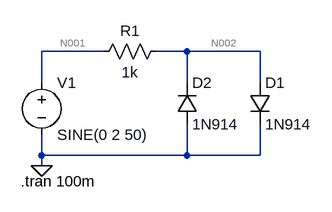
[diagram p0: schematic Lab2_fourth.asc]
Lab2_fourth.asc, the LTspice schematic file:
Version 4
SHEET 1 880 680
WIRE 64 48 -32 48
WIRE 192 48 144 48
WIRE 304 48 192 48
WIRE -32 96 -32 48
WIRE 192 96 192 48
WIRE 304 96 304 48
WIRE -32 208 -32 176
WIRE 192 208 192 160
WIRE 192 208 -32 208
WIRE 304 208 304 160
WIRE 304 208 192 208
WIRE -32 224 -32 208
FLAG -32 224 0
SYMBOL voltage -32 80 R0
WINDOW 123 0 0 Left 2
WINDOW 39 0 0 Left 2
SYMATTR InstName V1
SYMATTR Value SINE(0 2 50)
SYMBOL res 160 32 R90
WINDOW 0 0 56 VBottom 2
WINDOW 3 32 56 VTop 2
SYMATTR InstName R1
SYMATTR Value 1k
SYMBOL diode 288 96 R0
SYMATTR InstName D1
SYMATTR Value 1N914
SYMBOL diode 176 160 M180
WINDOW 0 24 64 Left 2
WINDOW 3 24 0 Left 2
SYMATTR InstName D2
SYMATTR Value 1N914
TEXT -64 248 Left 2 !.tran 100m

The netlist it stands for:
* Lab2_fourth.asc
V1 N001 0 SINE(0 2 50)
R1 N002 N001 1k
D1 N002 0 1N914
D2 0 N002 1N914
.model D D
.lib standard.dio
.tran 100m
.backanno
.end

* Results of the author's LTspice run, read from the files saved beside the schematic
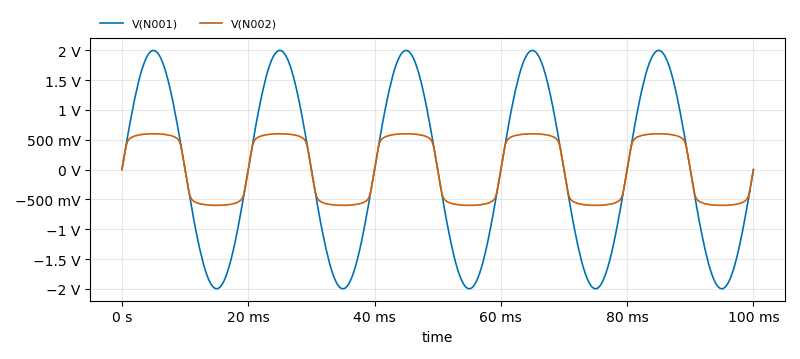
[diagram p1: Transient Analysis of Lab2_fourth.asc, plotted from the saved traces]
* Transient Analysis, 1 run:
*   V(N001): min -2 V, max 2 V, average -2.473 µV, rms 1.414 V, last 0 V
*   V(N002): min -600.2 mV, max 600.2 mV, average -2.479 µV, rms 535.2 mV, last -5.157 µV